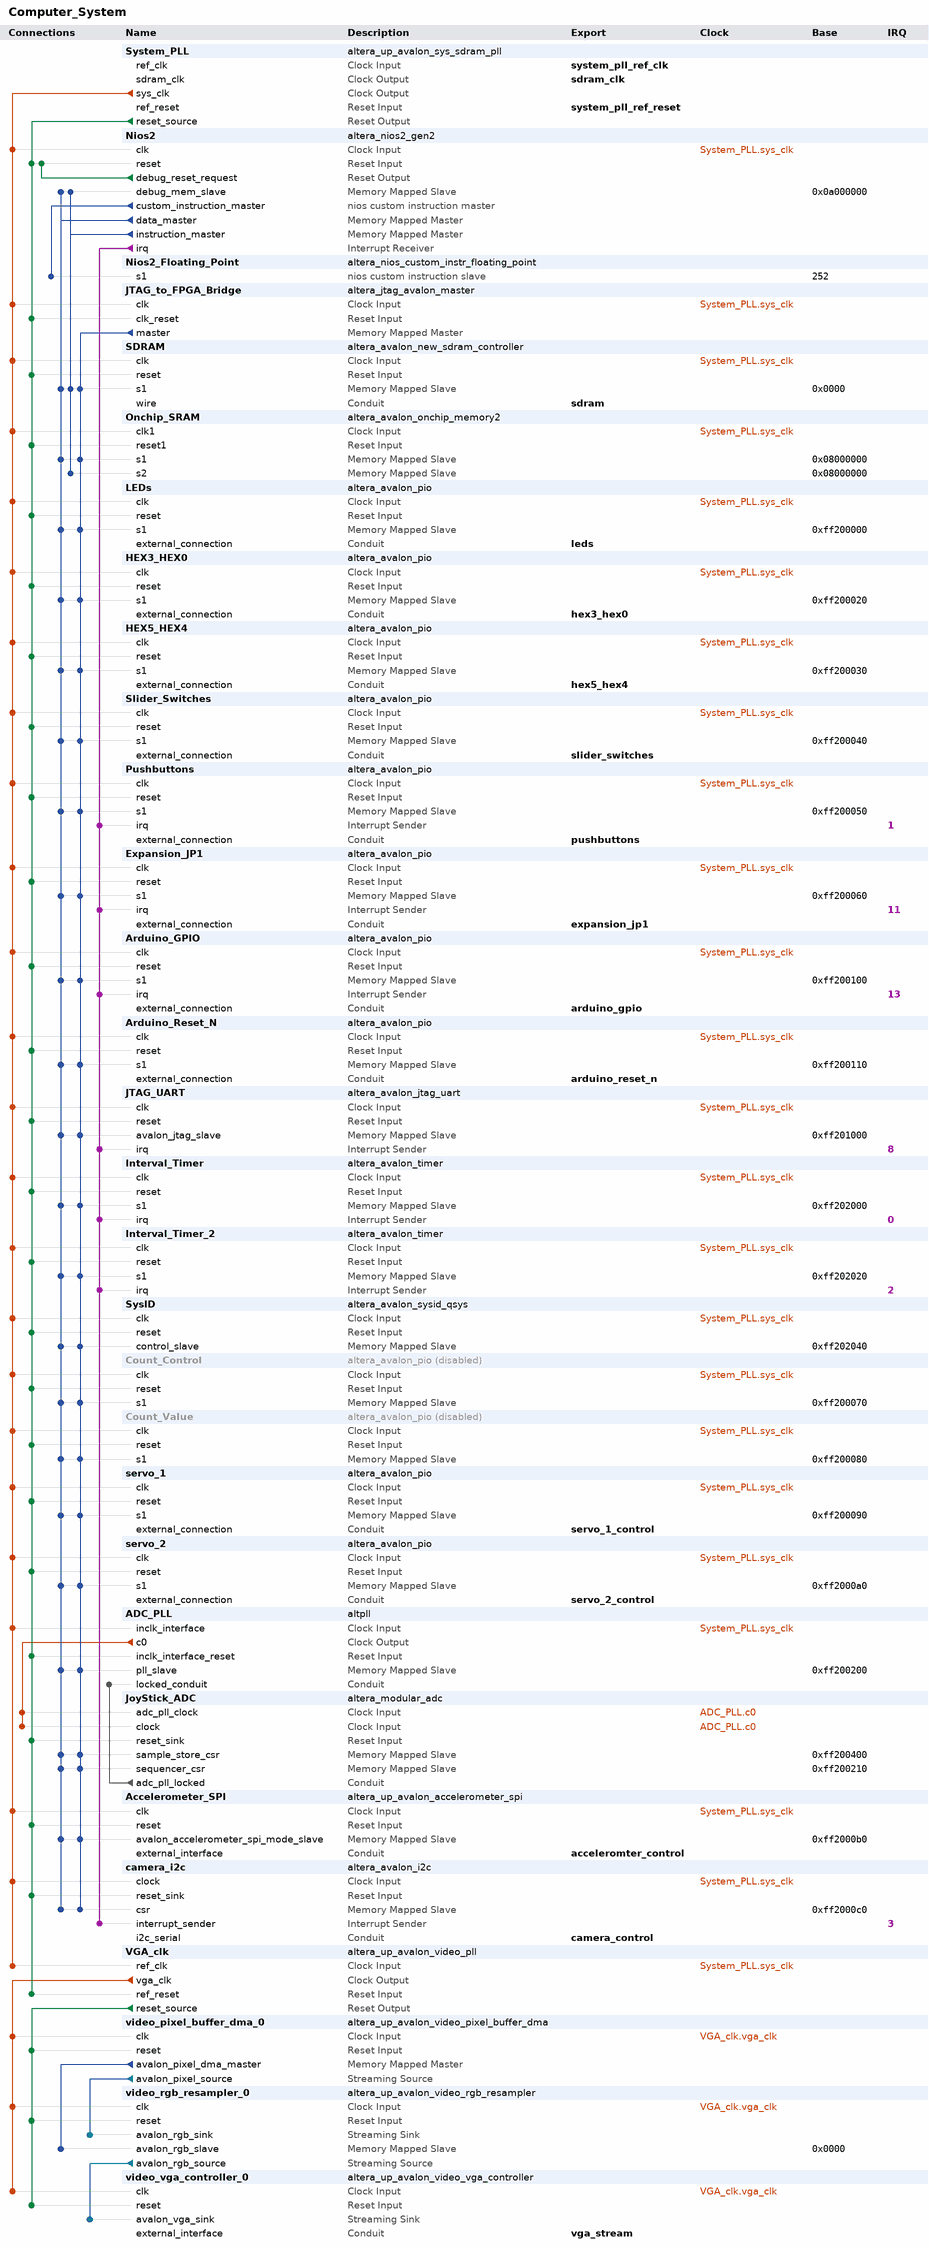
[diagram p0: system contents]
# Platform Designer (Qsys) system Computer_System, MAX 10 10M50DAF484C6GES
# Parameters at their usual value, and those the tool derives, are not listed.
package require -exact qsys 17.0
create_system Computer_System
set_project_property DEVICE_FAMILY {MAX 10}
set_project_property DEVICE 10M50DAF484C6GES

add_instance System_PLL altera_up_avalon_sys_sdram_pll 17.0
set_instance_parameter_value System_PLL CV_boards DE10-Standard
set_instance_parameter_value System_PLL gui_outclk 100.0
set_instance_parameter_value System_PLL gui_refclk 50.0

add_instance Nios2 altera_nios2_gen2 17.0
set_instance_parameter_value Nios2 dcache_size 0
set_instance_parameter_value Nios2 debug_datatrigger 2
set_instance_parameter_value Nios2 debug_hwbreakpoint 2
set_instance_parameter_value Nios2 debug_traceType instruction_trace
set_instance_parameter_value Nios2 dividerType srt2
set_instance_parameter_value Nios2 exceptionSlave SDRAM.s1
set_instance_parameter_value Nios2 icache_size 4096
set_instance_parameter_value Nios2 impl Tiny
set_instance_parameter_value Nios2 mul_64_impl 1
set_instance_parameter_value Nios2 mul_shift_choice 1
set_instance_parameter_value Nios2 resetSlave SDRAM.s1
set_instance_parameter_value Nios2 resetrequest_enabled false
set_instance_parameter_value Nios2 setting_support31bitdcachebypass false

add_instance Nios2_Floating_Point altera_nios_custom_instr_floating_point 17.0

add_instance JTAG_to_FPGA_Bridge altera_jtag_avalon_master 17.0

add_instance SDRAM altera_avalon_new_sdram_controller 17.0
set_instance_parameter_value SDRAM TAC 5.5
set_instance_parameter_value SDRAM TRCD 20.0
set_instance_parameter_value SDRAM TRP 20.0
set_instance_parameter_value SDRAM casLatency 3
set_instance_parameter_value SDRAM columnWidth 10
set_instance_parameter_value SDRAM dataWidth 16
set_instance_parameter_value SDRAM generateSimulationModel true
set_instance_parameter_value SDRAM model single_Micron_MT48LC4M32B2_7_chip
set_instance_parameter_value SDRAM numberOfBanks 4
set_instance_parameter_value SDRAM numberOfChipSelects 1
set_instance_parameter_value SDRAM powerUpDelay 100.0
set_instance_parameter_value SDRAM refreshPeriod 15.625
set_instance_parameter_value SDRAM rowWidth 13

add_instance Onchip_SRAM altera_avalon_onchip_memory2 17.0
set_instance_parameter_value Onchip_SRAM dataWidth 32
set_instance_parameter_value Onchip_SRAM dualPort true
set_instance_parameter_value Onchip_SRAM initMemContent true
set_instance_parameter_value Onchip_SRAM initializationFileName onchip_mem.hex
set_instance_parameter_value Onchip_SRAM memorySize 65536
set_instance_parameter_value Onchip_SRAM singleClockOperation true

add_instance LEDs altera_avalon_pio 17.0
set_instance_parameter_value LEDs direction Output
set_instance_parameter_value LEDs width 10

add_instance HEX3_HEX0 altera_avalon_pio 17.0
set_instance_parameter_value HEX3_HEX0 direction Output
set_instance_parameter_value HEX3_HEX0 width 32

add_instance HEX5_HEX4 altera_avalon_pio 17.0
set_instance_parameter_value HEX5_HEX4 direction Output
set_instance_parameter_value HEX5_HEX4 width 16

add_instance Slider_Switches altera_avalon_pio 17.0
set_instance_parameter_value Slider_Switches direction Input
set_instance_parameter_value Slider_Switches simDoTestBenchWiring true
set_instance_parameter_value Slider_Switches width 10

add_instance Pushbuttons altera_avalon_pio 17.0
set_instance_parameter_value Pushbuttons bitClearingEdgeCapReg true
set_instance_parameter_value Pushbuttons captureEdge true
set_instance_parameter_value Pushbuttons direction Input
set_instance_parameter_value Pushbuttons edgeType FALLING
set_instance_parameter_value Pushbuttons generateIRQ true
set_instance_parameter_value Pushbuttons irqType EDGE
set_instance_parameter_value Pushbuttons simDoTestBenchWiring true
set_instance_parameter_value Pushbuttons width 2

add_instance Expansion_JP1 altera_avalon_pio 17.0
set_instance_parameter_value Expansion_JP1 bitClearingEdgeCapReg true
set_instance_parameter_value Expansion_JP1 captureEdge true
set_instance_parameter_value Expansion_JP1 direction Bidir
set_instance_parameter_value Expansion_JP1 edgeType FALLING
set_instance_parameter_value Expansion_JP1 generateIRQ true
set_instance_parameter_value Expansion_JP1 irqType EDGE
set_instance_parameter_value Expansion_JP1 simDoTestBenchWiring true
set_instance_parameter_value Expansion_JP1 width 32

add_instance Arduino_GPIO altera_avalon_pio 17.0
set_instance_parameter_value Arduino_GPIO bitClearingEdgeCapReg true
set_instance_parameter_value Arduino_GPIO captureEdge true
set_instance_parameter_value Arduino_GPIO direction Bidir
set_instance_parameter_value Arduino_GPIO edgeType FALLING
set_instance_parameter_value Arduino_GPIO generateIRQ true
set_instance_parameter_value Arduino_GPIO irqType EDGE
set_instance_parameter_value Arduino_GPIO simDoTestBenchWiring true
set_instance_parameter_value Arduino_GPIO width 16

add_instance Arduino_Reset_N altera_avalon_pio 17.0
set_instance_parameter_value Arduino_Reset_N bitClearingEdgeCapReg true
set_instance_parameter_value Arduino_Reset_N captureEdge true
set_instance_parameter_value Arduino_Reset_N direction Output
set_instance_parameter_value Arduino_Reset_N edgeType FALLING
set_instance_parameter_value Arduino_Reset_N width 1

add_instance JTAG_UART altera_avalon_jtag_uart 17.0
set_instance_parameter_value JTAG_UART simInteractiveOptions NO_INTERACTIVE_WINDOWS

add_instance Interval_Timer altera_avalon_timer 17.0
set_instance_parameter_value Interval_Timer period 125.0
set_instance_parameter_value Interval_Timer periodUnits MSEC

add_instance Interval_Timer_2 altera_avalon_timer 17.0
set_instance_parameter_value Interval_Timer_2 period 125.0
set_instance_parameter_value Interval_Timer_2 periodUnits MSEC

add_instance SysID altera_avalon_sysid_qsys 17.0
set_instance_parameter_value SysID id 0

add_instance Count_Control altera_avalon_pio 17.0
set_instance_property Count_Control ENABLED false
set_instance_parameter_value Count_Control direction Output
set_instance_parameter_value Count_Control width 12

add_instance Count_Value altera_avalon_pio 17.0
set_instance_property Count_Value ENABLED false
set_instance_parameter_value Count_Value direction Input
set_instance_parameter_value Count_Value width 8

add_instance servo_1 altera_avalon_pio 17.0
set_instance_parameter_value servo_1 direction Output
set_instance_parameter_value servo_1 width 8

add_instance servo_2 altera_avalon_pio 17.0
set_instance_parameter_value servo_2 direction Output
set_instance_parameter_value servo_2 width 8

add_instance ADC_PLL altpll 17.0
set_instance_parameter_value ADC_PLL CLK0_DIVIDE_BY 10
set_instance_parameter_value ADC_PLL CLK0_MULTIPLY_BY 1
set_instance_parameter_value ADC_PLL INCLK0_INPUT_FREQUENCY 10000
set_instance_parameter_value ADC_PLL PORT_ARESET PORT_UNUSED
set_instance_parameter_value ADC_PLL PORT_LOCKED PORT_USED
set_instance_parameter_value ADC_PLL PORT_clk1 PORT_UNUSED
set_instance_parameter_value ADC_PLL PORT_clk2 PORT_UNUSED
set_instance_parameter_value ADC_PLL PORT_clk3 PORT_UNUSED

add_instance JoyStick_ADC altera_modular_adc 17.0
set_instance_parameter_value JoyStick_ADC CLOCK_FREQ 10000000
set_instance_parameter_value JoyStick_ADC CORE_VAR 0
set_instance_parameter_value JoyStick_ADC DEVICE_PART 10M50DAF484C6GES
set_instance_parameter_value JoyStick_ADC clkdiv 2
set_instance_parameter_value JoyStick_ADC int_vref_vr 3.0
set_instance_parameter_value JoyStick_ADC refsel 0
set_instance_parameter_value JoyStick_ADC sample_rate 0
set_instance_parameter_value JoyStick_ADC seq_order_length 2
set_instance_parameter_value JoyStick_ADC seq_order_slot_1 1
set_instance_parameter_value JoyStick_ADC seq_order_slot_2 2
set_instance_parameter_value JoyStick_ADC seq_order_slot_3 30
set_instance_parameter_value JoyStick_ADC seq_order_slot_4 30
set_instance_parameter_value JoyStick_ADC seq_order_slot_5 30
set_instance_parameter_value JoyStick_ADC seq_order_slot_6 30
set_instance_parameter_value JoyStick_ADC seq_order_slot_7 30
set_instance_parameter_value JoyStick_ADC use_ch0 false
set_instance_parameter_value JoyStick_ADC use_ch2 true
set_instance_parameter_value JoyStick_ADC use_ch3 false
set_instance_parameter_value JoyStick_ADC use_ch4 false
set_instance_parameter_value JoyStick_ADC use_ch5 false
set_instance_parameter_value JoyStick_ADC use_ch6 false
set_instance_parameter_value JoyStick_ADC use_ch7 false
set_instance_parameter_value JoyStick_ADC use_ch8 false
set_instance_parameter_value JoyStick_ADC use_tsd false

add_instance Accelerometer_SPI altera_up_avalon_accelerometer_spi 17.0

add_instance camera_i2c altera_avalon_i2c 17.0
set_instance_parameter_value camera_i2c FIFO_DEPTH 8

add_instance VGA_clk altera_up_avalon_video_pll 17.0
set_instance_parameter_value VGA_clk camera {5MP Digital Camera (THDB_D5M)}
set_instance_parameter_value VGA_clk gui_refclk 50.0
set_instance_parameter_value VGA_clk lcd {7" LCD on VEEK-MT and MTL/MTL2 Modules}

add_instance video_pixel_buffer_dma_0 altera_up_avalon_video_pixel_buffer_dma 17.0
set_instance_parameter_value video_pixel_buffer_dma_0 addr_mode X-Y
set_instance_parameter_value video_pixel_buffer_dma_0 back_start_address 0
set_instance_parameter_value video_pixel_buffer_dma_0 color_space {24-bit RGB}
set_instance_parameter_value video_pixel_buffer_dma_0 image_height 480
set_instance_parameter_value video_pixel_buffer_dma_0 image_width 640
set_instance_parameter_value video_pixel_buffer_dma_0 start_address 0

add_instance video_rgb_resampler_0 altera_up_avalon_video_rgb_resampler 17.0
set_instance_parameter_value video_rgb_resampler_0 alpha 1023
set_instance_parameter_value video_rgb_resampler_0 input_type {24-bit RGB}
set_instance_parameter_value video_rgb_resampler_0 output_type {30-bit RGB}

add_instance video_vga_controller_0 altera_up_avalon_video_vga_controller 17.0
set_instance_parameter_value video_vga_controller_0 board DE10-Lite
set_instance_parameter_value video_vga_controller_0 resolution {VGA 640x480}

# connections
add_connection ADC_PLL.c0 JoyStick_ADC.adc_pll_clock clock
add_connection ADC_PLL.c0 JoyStick_ADC.clock clock
add_connection System_PLL.sys_clk Accelerometer_SPI.clk clock
add_connection System_PLL.sys_clk ADC_PLL.inclk_interface clock
add_connection System_PLL.sys_clk Arduino_GPIO.clk clock
add_connection System_PLL.sys_clk Arduino_Reset_N.clk clock
add_connection System_PLL.sys_clk camera_i2c.clock clock
add_connection System_PLL.sys_clk Count_Control.clk clock
add_connection System_PLL.sys_clk Count_Value.clk clock
add_connection System_PLL.sys_clk Expansion_JP1.clk clock
add_connection System_PLL.sys_clk HEX3_HEX0.clk clock
add_connection System_PLL.sys_clk HEX5_HEX4.clk clock
add_connection System_PLL.sys_clk Interval_Timer.clk clock
add_connection System_PLL.sys_clk Interval_Timer_2.clk clock
add_connection System_PLL.sys_clk JTAG_to_FPGA_Bridge.clk clock
add_connection System_PLL.sys_clk JTAG_UART.clk clock
add_connection System_PLL.sys_clk LEDs.clk clock
add_connection System_PLL.sys_clk Nios2.clk clock
add_connection System_PLL.sys_clk Onchip_SRAM.clk1 clock
add_connection System_PLL.sys_clk Pushbuttons.clk clock
add_connection System_PLL.sys_clk SDRAM.clk clock
add_connection System_PLL.sys_clk servo_1.clk clock
add_connection System_PLL.sys_clk servo_2.clk clock
add_connection System_PLL.sys_clk Slider_Switches.clk clock
add_connection System_PLL.sys_clk SysID.clk clock
add_connection System_PLL.sys_clk VGA_clk.ref_clk clock
add_connection VGA_clk.vga_clk video_pixel_buffer_dma_0.clk clock
add_connection VGA_clk.vga_clk video_rgb_resampler_0.clk clock
add_connection VGA_clk.vga_clk video_vga_controller_0.clk clock
add_connection Nios2.debug_reset_request Nios2.reset reset
add_connection System_PLL.reset_source Accelerometer_SPI.reset reset
add_connection System_PLL.reset_source ADC_PLL.inclk_interface_reset reset
add_connection System_PLL.reset_source Arduino_GPIO.reset reset
add_connection System_PLL.reset_source Arduino_Reset_N.reset reset
add_connection System_PLL.reset_source camera_i2c.reset_sink reset
add_connection System_PLL.reset_source Count_Control.reset reset
add_connection System_PLL.reset_source Count_Value.reset reset
add_connection System_PLL.reset_source Expansion_JP1.reset reset
add_connection System_PLL.reset_source HEX3_HEX0.reset reset
add_connection System_PLL.reset_source HEX5_HEX4.reset reset
add_connection System_PLL.reset_source Interval_Timer.reset reset
add_connection System_PLL.reset_source Interval_Timer_2.reset reset
add_connection System_PLL.reset_source JoyStick_ADC.reset_sink reset
add_connection System_PLL.reset_source JTAG_to_FPGA_Bridge.clk_reset reset
add_connection System_PLL.reset_source JTAG_UART.reset reset
add_connection System_PLL.reset_source LEDs.reset reset
add_connection System_PLL.reset_source Nios2.reset reset
add_connection System_PLL.reset_source Onchip_SRAM.reset1 reset
add_connection System_PLL.reset_source Pushbuttons.reset reset
add_connection System_PLL.reset_source SDRAM.reset reset
add_connection System_PLL.reset_source servo_1.reset reset
add_connection System_PLL.reset_source servo_2.reset reset
add_connection System_PLL.reset_source Slider_Switches.reset reset
add_connection System_PLL.reset_source SysID.reset reset
add_connection System_PLL.reset_source VGA_clk.ref_reset reset
add_connection VGA_clk.reset_source video_pixel_buffer_dma_0.reset reset
add_connection VGA_clk.reset_source video_rgb_resampler_0.reset reset
add_connection VGA_clk.reset_source video_vga_controller_0.reset reset
add_connection JTAG_to_FPGA_Bridge.master Accelerometer_SPI.avalon_accelerometer_spi_mode_slave avalon
set_connection_parameter_value JTAG_to_FPGA_Bridge.master/Accelerometer_SPI.avalon_accelerometer_spi_mode_slave baseAddress 0xff2000b0
add_connection JTAG_to_FPGA_Bridge.master ADC_PLL.pll_slave avalon
set_connection_parameter_value JTAG_to_FPGA_Bridge.master/ADC_PLL.pll_slave baseAddress 0xff200200
add_connection JTAG_to_FPGA_Bridge.master Arduino_GPIO.s1 avalon
set_connection_parameter_value JTAG_to_FPGA_Bridge.master/Arduino_GPIO.s1 baseAddress 0xff200100
add_connection JTAG_to_FPGA_Bridge.master Arduino_Reset_N.s1 avalon
set_connection_parameter_value JTAG_to_FPGA_Bridge.master/Arduino_Reset_N.s1 baseAddress 0xff200110
add_connection JTAG_to_FPGA_Bridge.master camera_i2c.csr avalon
set_connection_parameter_value JTAG_to_FPGA_Bridge.master/camera_i2c.csr baseAddress 0xff2000c0
add_connection JTAG_to_FPGA_Bridge.master Count_Control.s1 avalon
set_connection_parameter_value JTAG_to_FPGA_Bridge.master/Count_Control.s1 baseAddress 0xff200070
add_connection JTAG_to_FPGA_Bridge.master Count_Value.s1 avalon
set_connection_parameter_value JTAG_to_FPGA_Bridge.master/Count_Value.s1 baseAddress 0xff200080
add_connection JTAG_to_FPGA_Bridge.master Expansion_JP1.s1 avalon
set_connection_parameter_value JTAG_to_FPGA_Bridge.master/Expansion_JP1.s1 baseAddress 0xff200060
add_connection JTAG_to_FPGA_Bridge.master HEX3_HEX0.s1 avalon
set_connection_parameter_value JTAG_to_FPGA_Bridge.master/HEX3_HEX0.s1 baseAddress 0xff200020
add_connection JTAG_to_FPGA_Bridge.master HEX5_HEX4.s1 avalon
set_connection_parameter_value JTAG_to_FPGA_Bridge.master/HEX5_HEX4.s1 baseAddress 0xff200030
add_connection JTAG_to_FPGA_Bridge.master Interval_Timer.s1 avalon
set_connection_parameter_value JTAG_to_FPGA_Bridge.master/Interval_Timer.s1 baseAddress 0xff202000
add_connection JTAG_to_FPGA_Bridge.master Interval_Timer_2.s1 avalon
set_connection_parameter_value JTAG_to_FPGA_Bridge.master/Interval_Timer_2.s1 baseAddress 0xff202020
add_connection JTAG_to_FPGA_Bridge.master JoyStick_ADC.sample_store_csr avalon
set_connection_parameter_value JTAG_to_FPGA_Bridge.master/JoyStick_ADC.sample_store_csr baseAddress 0xff200400
add_connection JTAG_to_FPGA_Bridge.master JoyStick_ADC.sequencer_csr avalon
set_connection_parameter_value JTAG_to_FPGA_Bridge.master/JoyStick_ADC.sequencer_csr baseAddress 0xff200210
add_connection JTAG_to_FPGA_Bridge.master JTAG_UART.avalon_jtag_slave avalon
set_connection_parameter_value JTAG_to_FPGA_Bridge.master/JTAG_UART.avalon_jtag_slave baseAddress 0xff201000
add_connection JTAG_to_FPGA_Bridge.master LEDs.s1 avalon
set_connection_parameter_value JTAG_to_FPGA_Bridge.master/LEDs.s1 baseAddress 0xff200000
add_connection JTAG_to_FPGA_Bridge.master Onchip_SRAM.s1 avalon
set_connection_parameter_value JTAG_to_FPGA_Bridge.master/Onchip_SRAM.s1 baseAddress 0x08000000
add_connection JTAG_to_FPGA_Bridge.master Pushbuttons.s1 avalon
set_connection_parameter_value JTAG_to_FPGA_Bridge.master/Pushbuttons.s1 baseAddress 0xff200050
add_connection JTAG_to_FPGA_Bridge.master SDRAM.s1 avalon
set_connection_parameter_value JTAG_to_FPGA_Bridge.master/SDRAM.s1 baseAddress 0x0000
add_connection JTAG_to_FPGA_Bridge.master servo_1.s1 avalon
set_connection_parameter_value JTAG_to_FPGA_Bridge.master/servo_1.s1 baseAddress 0xff200090
add_connection JTAG_to_FPGA_Bridge.master servo_2.s1 avalon
set_connection_parameter_value JTAG_to_FPGA_Bridge.master/servo_2.s1 baseAddress 0xff2000a0
add_connection JTAG_to_FPGA_Bridge.master Slider_Switches.s1 avalon
set_connection_parameter_value JTAG_to_FPGA_Bridge.master/Slider_Switches.s1 baseAddress 0xff200040
add_connection JTAG_to_FPGA_Bridge.master SysID.control_slave avalon
set_connection_parameter_value JTAG_to_FPGA_Bridge.master/SysID.control_slave baseAddress 0xff202040
add_connection Nios2.data_master Accelerometer_SPI.avalon_accelerometer_spi_mode_slave avalon
set_connection_parameter_value Nios2.data_master/Accelerometer_SPI.avalon_accelerometer_spi_mode_slave baseAddress 0xff2000b0
add_connection Nios2.data_master ADC_PLL.pll_slave avalon
set_connection_parameter_value Nios2.data_master/ADC_PLL.pll_slave baseAddress 0xff200200
add_connection Nios2.data_master Arduino_GPIO.s1 avalon
set_connection_parameter_value Nios2.data_master/Arduino_GPIO.s1 baseAddress 0xff200100
add_connection Nios2.data_master Arduino_Reset_N.s1 avalon
set_connection_parameter_value Nios2.data_master/Arduino_Reset_N.s1 baseAddress 0xff200110
add_connection Nios2.data_master camera_i2c.csr avalon
set_connection_parameter_value Nios2.data_master/camera_i2c.csr baseAddress 0xff2000c0
add_connection Nios2.data_master Count_Control.s1 avalon
set_connection_parameter_value Nios2.data_master/Count_Control.s1 baseAddress 0xff200070
add_connection Nios2.data_master Count_Value.s1 avalon
set_connection_parameter_value Nios2.data_master/Count_Value.s1 baseAddress 0xff200080
add_connection Nios2.data_master Expansion_JP1.s1 avalon
set_connection_parameter_value Nios2.data_master/Expansion_JP1.s1 baseAddress 0xff200060
add_connection Nios2.data_master HEX3_HEX0.s1 avalon
set_connection_parameter_value Nios2.data_master/HEX3_HEX0.s1 baseAddress 0xff200020
add_connection Nios2.data_master HEX5_HEX4.s1 avalon
set_connection_parameter_value Nios2.data_master/HEX5_HEX4.s1 baseAddress 0xff200030
add_connection Nios2.data_master Interval_Timer.s1 avalon
set_connection_parameter_value Nios2.data_master/Interval_Timer.s1 baseAddress 0xff202000
add_connection Nios2.data_master Interval_Timer_2.s1 avalon
set_connection_parameter_value Nios2.data_master/Interval_Timer_2.s1 baseAddress 0xff202020
add_connection Nios2.data_master JoyStick_ADC.sample_store_csr avalon
set_connection_parameter_value Nios2.data_master/JoyStick_ADC.sample_store_csr baseAddress 0xff200400
add_connection Nios2.data_master JoyStick_ADC.sequencer_csr avalon
set_connection_parameter_value Nios2.data_master/JoyStick_ADC.sequencer_csr baseAddress 0xff200210
add_connection Nios2.data_master JTAG_UART.avalon_jtag_slave avalon
set_connection_parameter_value Nios2.data_master/JTAG_UART.avalon_jtag_slave baseAddress 0xff201000
add_connection Nios2.data_master LEDs.s1 avalon
set_connection_parameter_value Nios2.data_master/LEDs.s1 baseAddress 0xff200000
add_connection Nios2.data_master Nios2.debug_mem_slave avalon
set_connection_parameter_value Nios2.data_master/Nios2.debug_mem_slave baseAddress 0x0a000000
add_connection Nios2.data_master Onchip_SRAM.s1 avalon
set_connection_parameter_value Nios2.data_master/Onchip_SRAM.s1 baseAddress 0x08000000
add_connection Nios2.data_master Pushbuttons.s1 avalon
set_connection_parameter_value Nios2.data_master/Pushbuttons.s1 baseAddress 0xff200050
add_connection Nios2.data_master SDRAM.s1 avalon
set_connection_parameter_value Nios2.data_master/SDRAM.s1 baseAddress 0x0000
add_connection Nios2.data_master servo_1.s1 avalon
set_connection_parameter_value Nios2.data_master/servo_1.s1 baseAddress 0xff200090
add_connection Nios2.data_master servo_2.s1 avalon
set_connection_parameter_value Nios2.data_master/servo_2.s1 baseAddress 0xff2000a0
add_connection Nios2.data_master Slider_Switches.s1 avalon
set_connection_parameter_value Nios2.data_master/Slider_Switches.s1 baseAddress 0xff200040
add_connection Nios2.data_master SysID.control_slave avalon
set_connection_parameter_value Nios2.data_master/SysID.control_slave baseAddress 0xff202040
add_connection Nios2.instruction_master Nios2.debug_mem_slave avalon
set_connection_parameter_value Nios2.instruction_master/Nios2.debug_mem_slave baseAddress 0x0a000000
add_connection Nios2.instruction_master Onchip_SRAM.s2 avalon
set_connection_parameter_value Nios2.instruction_master/Onchip_SRAM.s2 baseAddress 0x08000000
add_connection Nios2.instruction_master SDRAM.s1 avalon
set_connection_parameter_value Nios2.instruction_master/SDRAM.s1 baseAddress 0x0000
add_connection video_pixel_buffer_dma_0.avalon_pixel_dma_master video_rgb_resampler_0.avalon_rgb_slave avalon
set_connection_parameter_value video_pixel_buffer_dma_0.avalon_pixel_dma_master/video_rgb_resampler_0.avalon_rgb_slave baseAddress 0x0000
add_connection video_pixel_buffer_dma_0.avalon_pixel_source video_rgb_resampler_0.avalon_rgb_sink avalon_streaming
add_connection video_rgb_resampler_0.avalon_rgb_source video_vga_controller_0.avalon_vga_sink avalon_streaming
add_connection JoyStick_ADC.adc_pll_locked ADC_PLL.locked_conduit conduit
add_connection Nios2.irq Arduino_GPIO.irq interrupt
set_connection_parameter_value Nios2.irq/Arduino_GPIO.irq irqNumber 13
add_connection Nios2.irq camera_i2c.interrupt_sender interrupt
set_connection_parameter_value Nios2.irq/camera_i2c.interrupt_sender irqNumber 3
add_connection Nios2.irq Expansion_JP1.irq interrupt
set_connection_parameter_value Nios2.irq/Expansion_JP1.irq irqNumber 11
add_connection Nios2.irq Interval_Timer.irq interrupt
set_connection_parameter_value Nios2.irq/Interval_Timer.irq irqNumber 0
add_connection Nios2.irq Interval_Timer_2.irq interrupt
set_connection_parameter_value Nios2.irq/Interval_Timer_2.irq irqNumber 2
add_connection Nios2.irq JTAG_UART.irq interrupt
set_connection_parameter_value Nios2.irq/JTAG_UART.irq irqNumber 8
add_connection Nios2.irq Pushbuttons.irq interrupt
set_connection_parameter_value Nios2.irq/Pushbuttons.irq irqNumber 1
add_connection Nios2.custom_instruction_master Nios2_Floating_Point.s1 nios_custom_instruction
set_connection_parameter_value Nios2.custom_instruction_master/Nios2_Floating_Point.s1 CIName nios2_floating_point
set_connection_parameter_value Nios2.custom_instruction_master/Nios2_Floating_Point.s1 baseAddress 252

# exported interfaces
add_interface acceleromter_control conduit end
set_interface_property acceleromter_control EXPORT_OF Accelerometer_SPI.external_interface
add_interface arduino_gpio conduit end
set_interface_property arduino_gpio EXPORT_OF Arduino_GPIO.external_connection
add_interface arduino_reset_n conduit end
set_interface_property arduino_reset_n EXPORT_OF Arduino_Reset_N.external_connection
add_interface camera_control conduit end
set_interface_property camera_control EXPORT_OF camera_i2c.i2c_serial
add_interface expansion_jp1 conduit end
set_interface_property expansion_jp1 EXPORT_OF Expansion_JP1.external_connection
add_interface hex3_hex0 conduit end
set_interface_property hex3_hex0 EXPORT_OF HEX3_HEX0.external_connection
add_interface hex5_hex4 conduit end
set_interface_property hex5_hex4 EXPORT_OF HEX5_HEX4.external_connection
add_interface leds conduit end
set_interface_property leds EXPORT_OF LEDs.external_connection
add_interface pushbuttons conduit end
set_interface_property pushbuttons EXPORT_OF Pushbuttons.external_connection
add_interface sdram conduit end
set_interface_property sdram EXPORT_OF SDRAM.wire
add_interface sdram_clk clock source
set_interface_property sdram_clk EXPORT_OF System_PLL.sdram_clk
add_interface servo_1_control conduit end
set_interface_property servo_1_control EXPORT_OF servo_1.external_connection
add_interface servo_2_control conduit end
set_interface_property servo_2_control EXPORT_OF servo_2.external_connection
add_interface slider_switches conduit end
set_interface_property slider_switches EXPORT_OF Slider_Switches.external_connection
add_interface system_pll_ref_clk clock sink
set_interface_property system_pll_ref_clk EXPORT_OF System_PLL.ref_clk
add_interface system_pll_ref_reset reset sink
set_interface_property system_pll_ref_reset EXPORT_OF System_PLL.ref_reset
add_interface vga_stream conduit end
set_interface_property vga_stream EXPORT_OF video_vga_controller_0.external_interface

set_interconnect_requirement {$system} qsys_mm.clockCrossingAdapter HANDSHAKE
set_interconnect_requirement {$system} qsys_mm.enableEccProtection FALSE
set_interconnect_requirement {$system} qsys_mm.insertDefaultSlave FALSE
set_interconnect_requirement {$system} qsys_mm.maxAdditionalLatency 1

save_system Computer_System.qsys
